# Altium schematic sheet FP_A_TTypeFBTxs.SchDoc
size A4; SheetNumber: 1; SheetTotal: 2
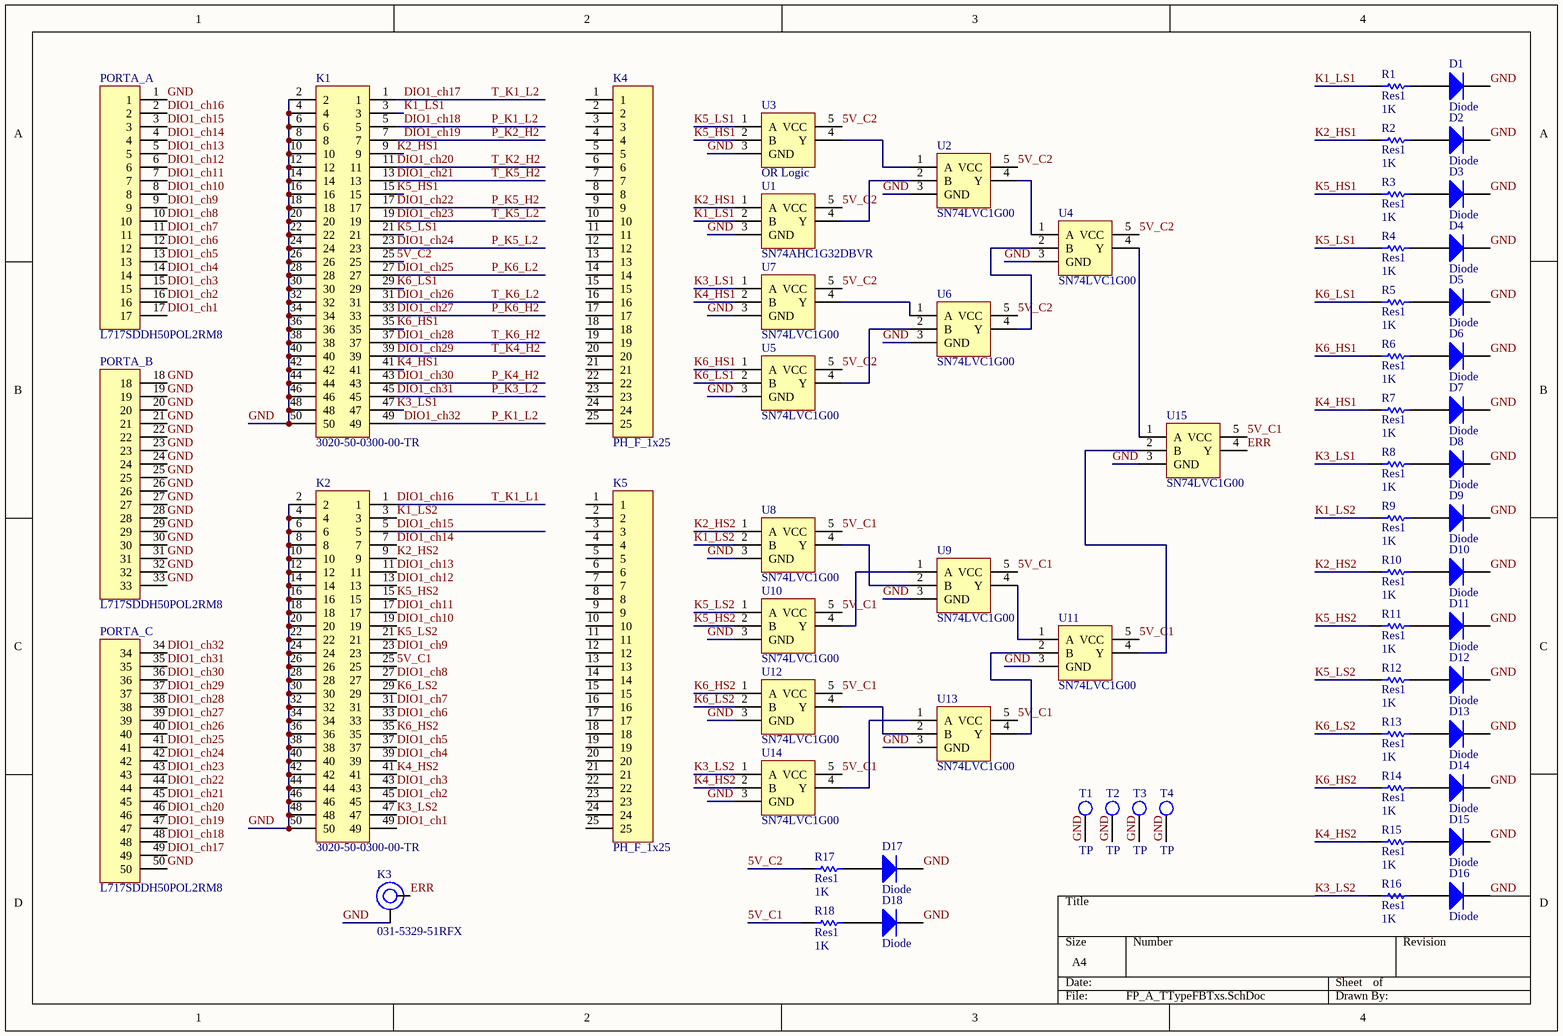
[diagram p0: FP_A_TTypeFBTxs.SchDoc]

## Parts
D1  Diode  [0603]
D2  Diode  [0603]
D3  Diode  [0603]
D4  Diode  [0603]
D5  Diode  [0603]
D6  Diode  [0603]
D7  Diode  [0603]
D8  Diode  [0603]
D9  Diode  [0603]
D10  Diode  [0603]
D11  Diode  [0603]
D12  Diode  [0603]
D13  Diode  [0603]
D14  Diode  [0603]
D15  Diode  [0603]
D16  Diode  [0603]
D17  Diode  [0603]
D18  Diode  [0603]
K1  3020-50-0300-00-TR  [IDC_2x50]
K2  3020-50-0300-00-TR  [IDC_2x50]
K3  031-5329-51RFX  [BNC_PCB]
K4  PH_F_1x25  [PH_F_1x25]
K5  PH_F_1x25  [PH_F_1x25]
PORTA_  L717SDDH50POL2RM8  [L717SDDH50POL2RM8]  (parts A,B,C of 3)
R1  Res1  value 1K  [0603]
R2  Res1  value 1K  [0603]
R3  Res1  value 1K  [0603]
R4  Res1  value 1K  [0603]
R5  Res1  value 1K  [0603]
R6  Res1  value 1K  [0603]
R7  Res1  value 1K  [0603]
R8  Res1  value 1K  [0603]
R9  Res1  value 1K  [0603]
R10  Res1  value 1K  [0603]
R11  Res1  value 1K  [0603]
R12  Res1  value 1K  [0603]
R13  Res1  value 1K  [0603]
R14  Res1  value 1K  [0603]
R15  Res1  value 1K  [0603]
R16  Res1  value 1K  [0603]
R17  Res1  value 1K  [0603]
R18  Res1  value 1K  [0603]
T1  TP  [TP]
T2  TP  [TP]
T3  TP  [TP]
T4  TP  [TP]
U1  SN74AHC1G32DBVR  [sot23]
U2  SN74LVC1G00  [sot23]
U3  OR Logic  [sot23]
U4  SN74LVC1G00  [sot23]
U5  SN74LVC1G00  [sot23]
U6  SN74LVC1G00  [sot23]
U7  SN74LVC1G00  [sot23]
U8  SN74LVC1G00  [sot23]
U9  SN74LVC1G00  [sot23]
U10  SN74LVC1G00  [sot23]
U11  SN74LVC1G00  [sot23]
U12  SN74LVC1G00  [sot23]
U13  SN74LVC1G00  [sot23]
U14  SN74LVC1G00  [sot23]
U15  SN74LVC1G00  [sot23]

## Nets
5V_C1: K2.25 R18.2 U8.5(VCC) U9.5(VCC) U10.5(VCC) U11.5(VCC) U12.5(VCC) U13.5(VCC) U14.5(VCC) U15.5(VCC)
5V_C2: K1.25 R17.2 U1.5(VCC) U2.5(VCC) U3.5(VCC) U4.5(VCC) U5.5(VCC) U6.5(VCC) U7.5(VCC)
DIO1_ch1: K2.49 PORTA_.17
DIO1_ch2: K2.45 PORTA_.16
DIO1_ch3: K2.43 PORTA_.15
DIO1_ch4: K2.39 PORTA_.14
DIO1_ch5: K2.37 PORTA_.13
DIO1_ch6: K2.33 PORTA_.12
DIO1_ch7: K2.31 PORTA_.11
DIO1_ch8: K2.27 PORTA_.10
DIO1_ch9: K2.23 PORTA_.9
DIO1_ch10: K2.19 PORTA_.8
DIO1_ch11: K2.17 PORTA_.7
DIO1_ch12: K2.13 PORTA_.6
DIO1_ch13: K2.11 PORTA_.5
DIO1_ch14: K2.7 PORTA_.4
DIO1_ch15: K2.5 PORTA_.3
DIO1_ch16: K2.1 PORTA_.2  [also labelled T_K1_L1]
DIO1_ch17: K1.1 PORTA_.49  [also labelled T_K1_L2]
DIO1_ch18: K1.5 K1.49 PORTA_.34 PORTA_.48  [also labelled DIO1_ch32, P_K1_L2]
DIO1_ch19: K1.7 PORTA_.47  [also labelled P_K2_H2]
DIO1_ch20: K1.11 PORTA_.46  [also labelled T_K2_H2]
DIO1_ch21: K1.13 PORTA_.45  [also labelled T_K5_H2]
DIO1_ch22: K1.17 PORTA_.44  [also labelled P_K5_H2]
DIO1_ch23: K1.19 PORTA_.43  [also labelled T_K5_L2]
DIO1_ch24: K1.23 PORTA_.42  [also labelled P_K5_L2]
DIO1_ch25: K1.27 PORTA_.41  [also labelled P_K6_L2]
DIO1_ch26: K1.31 PORTA_.40  [also labelled T_K6_L2]
DIO1_ch27: K1.33 PORTA_.39  [also labelled P_K6_H2]
DIO1_ch28: K1.37 PORTA_.38  [also labelled T_K6_H2]
DIO1_ch29: K1.39 PORTA_.37  [also labelled T_K4_H2]
DIO1_ch30: K1.43 PORTA_.36  [also labelled P_K4_H2]
DIO1_ch31: K1.45 PORTA_.35  [also labelled P_K3_L2]
ERR: K3.1 U15.4(Y)
GND: D1.2(K) D2.2(K) D3.2(K) D4.2(K) D5.2(K) D6.2(K) D7.2(K) D8.2(K) D9.2(K) D10.2(K) D11.2(K) D12.2(K) D13.2(K) D14.2(K) D15.2(K) D16.2(K) D17.2(K) D18.2(K) K1.2 K1.4 K1.6 K1.8 K1.10 K1.12 K1.14 K1.16 K1.18 K1.20 K1.22 K1.24 K1.26 K1.28 K1.30 K1.32 K1.34 K1.36 K1.38 K1.40 K1.42 K1.44 K1.46 K1.48 K1.50 K2.2 K2.4 K2.6 K2.8 K2.10 K2.12 K2.14 K2.16 K2.18 K2.20 K2.22 K2.24 K2.26 K2.28 K2.30 K2.32 K2.34 K2.36 K2.38 K2.40 K2.42 K2.44 K2.46 K2.48 K2.50 K3.2 PORTA_.1 PORTA_.18 PORTA_.19 PORTA_.20 PORTA_.21 PORTA_.22 PORTA_.23 PORTA_.24 PORTA_.25 PORTA_.26 PORTA_.27 PORTA_.28 PORTA_.29 PORTA_.30 PORTA_.31 PORTA_.32 PORTA_.33 PORTA_.50 T1.1 T2.1 T3.1 T4.1 U1.3(GND) U2.3(GND) U3.3(GND) U4.3(GND) U5.3(GND) U6.3(GND) U7.3(GND) U8.3(GND) U9.3(GND) U10.3(GND) U11.3(GND) U12.3(GND) U13.3(GND) U14.3(GND) U15.3(GND)
K1_LS1: K1.3 R1.2 U1.2(B)
K1_LS2: K2.3 R9.2 U8.2(B)
K2_HS1: K1.9 R2.2 U1.1(A)
K2_HS2: K2.9 R10.2 U8.1(A)
K3_LS1: K1.47 R8.2 U7.1(A)
K3_LS2: K2.47 R16.2 U14.1(A)
K4_HS1: K1.41 R7.2 U7.2(B)
K4_HS2: K2.41 R15.2 U14.2(B)
K5_HS1: K1.15 R3.2 U3.2(B)
K5_HS2: K2.15 R11.2 U10.2(B)
K5_LS1: K1.21 R4.2 U3.1(A)
K5_LS2: K2.21 R12.2 U10.1(A)
K6_HS1: K1.35 R6.2 U5.1(A)
K6_HS2: K2.35 R14.2 U12.1(A)
K6_LS1: K1.29 R5.2 U5.2(B)
K6_LS2: K2.29 R13.2 U12.2(B)
NetD1_1: D1.1(A) R1.1
NetD2_1: D2.1(A) R2.1
NetD3_1: D3.1(A) R3.1
NetD4_1: D4.1(A) R4.1
NetD5_1: D5.1(A) R5.1
NetD6_1: D6.1(A) R6.1
NetD7_1: D7.1(A) R7.1
NetD8_1: D8.1(A) R8.1
NetD9_1: D9.1(A) R9.1
NetD10_1: D10.1(A) R10.1
NetD11_1: D11.1(A) R11.1
NetD12_1: D12.1(A) R12.1
NetD13_1: D13.1(A) R13.1
NetD14_1: D14.1(A) R14.1
NetD15_1: D15.1(A) R15.1
NetD16_1: D16.1(A) R16.1
NetD17_1: D17.1(A) R17.1
NetD18_1: D18.1(A) R18.1
NetU1_4: U1.4(Y) U2.2(B)
NetU2_1: U2.1(A) U3.4(Y)
NetU2_4: U2.4(Y) U4.1(A)
NetU4_2: U4.2(B) U6.4(Y)
NetU4_4: U4.4(Y) U15.1(A)
NetU5_4: U5.4(Y) U6.2(B)
NetU6_1: U6.1(A) U7.4(Y)
NetU8_4: U8.4(Y) U9.2(B)
NetU9_1: U9.1(A) U10.4(Y)
NetU9_4: U9.4(Y) U11.1(A)
NetU11_2: U11.2(B) U13.4(Y)
NetU11_4: U11.4(Y) U15.2(B)
NetU12_4: U12.4(Y) U13.2(B)
NetU13_1: U13.1(A) U14.4(Y)

Not connected (* = marked no-connect by the designer): K4 1 2 3 4 5 6 7 8 9 10 11 12 13 14 15 16 17 18 19 20 21 22 23 24 25; K5 1 2 3 4 5 6 7 8 9 10 11 12 13 14 15 16 17 18 19 20 21 22 23 24 25

## Library data of the parts
D1-D18 = Diode: Default Diode; Published: 8-Jun-2000; LatestRevisionDate: 17-Jul-2002; LatestRevisionNote: Re-released for DXP Platform.; PackageVersion: Sep-1996; PackageReference: SMC; Publisher: Altium Limited; PackageDescription: DO-214-AB/SMC; 2 C-Bend Leads; Body 7.9 x 5.9 mm, inc. leads (LxW); Code_JEDEC: DO-214-AB
R1-R18 = Res1: Resistor; Published: 8-Jun-2000; LatestRevisionDate: 17-Jul-2002; LatestRevisionNote: Re-released for DXP Platform.; PackageReference: AXIAL-0.3; Publisher: Altium Limited; PackageDescription: Axial Device, Thru-Hole; 2 Leads; 0.3 in Pin Spacing
U3 = SN74AHC1G32DBVR